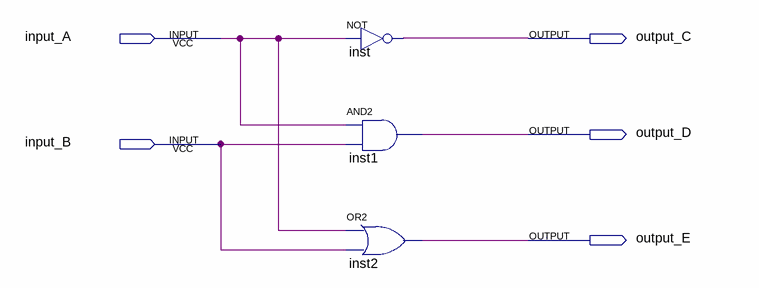
[diagram p0: schematic sheet]
// Quartus schematic schematic.bdf as structural Verilog: 3 symbols, 5 pins
module schematic (
  input  input_A,
  input  input_B,
  output output_C,
  output output_D,
  output output_E
);

  not inst (output_C, input_A);
  and inst1 (output_D, input_A, input_B);
  or inst2 (output_E, input_A, input_B);
endmodule
